# Altium schematic sheet SafetySwitch.SchDoc
size A3; SheetNumber: 1; SheetTotal: 1
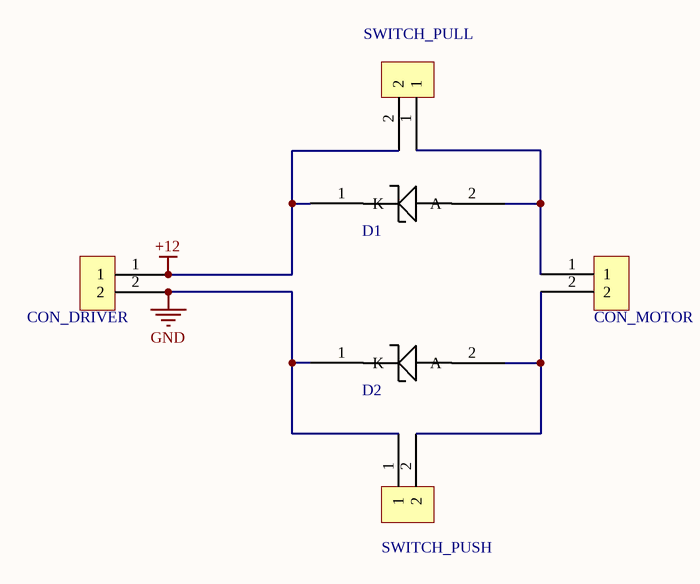
[diagram p0: SafetySwitch.SchDoc]

## Parts
CON_DRIVER  KF301-5.0-2P  [KF301-5.0-2P]  (value not drawn)
CON_MOTOR  KF301-5.0-2P  [KF301-5.0-2P]  (value not drawn)
D1  CMS04  (value not drawn)
D2  CMS04  (value not drawn)
SWITCH_PULL  KF301-5.0-2P  [KF301-5.0-2P]  (value not drawn)
SWITCH_PUSH  KF301-5.0-2P  [KF301-5.0-2P]  (value not drawn)

## Nets
+12: CON_DRIVER.1 D1.1(K) SWITCH_PULL.2
GND: CON_DRIVER.2 D2.1(K) SWITCH_PUSH.1
NetCON_MOTOR_1: CON_MOTOR.1 D1.2(A) SWITCH_PULL.1
NetCON_MOTOR_2: CON_MOTOR.2 D2.2(A) SWITCH_PUSH.2